# Altium project MB1292.PrjPcb (part 1 of 2)
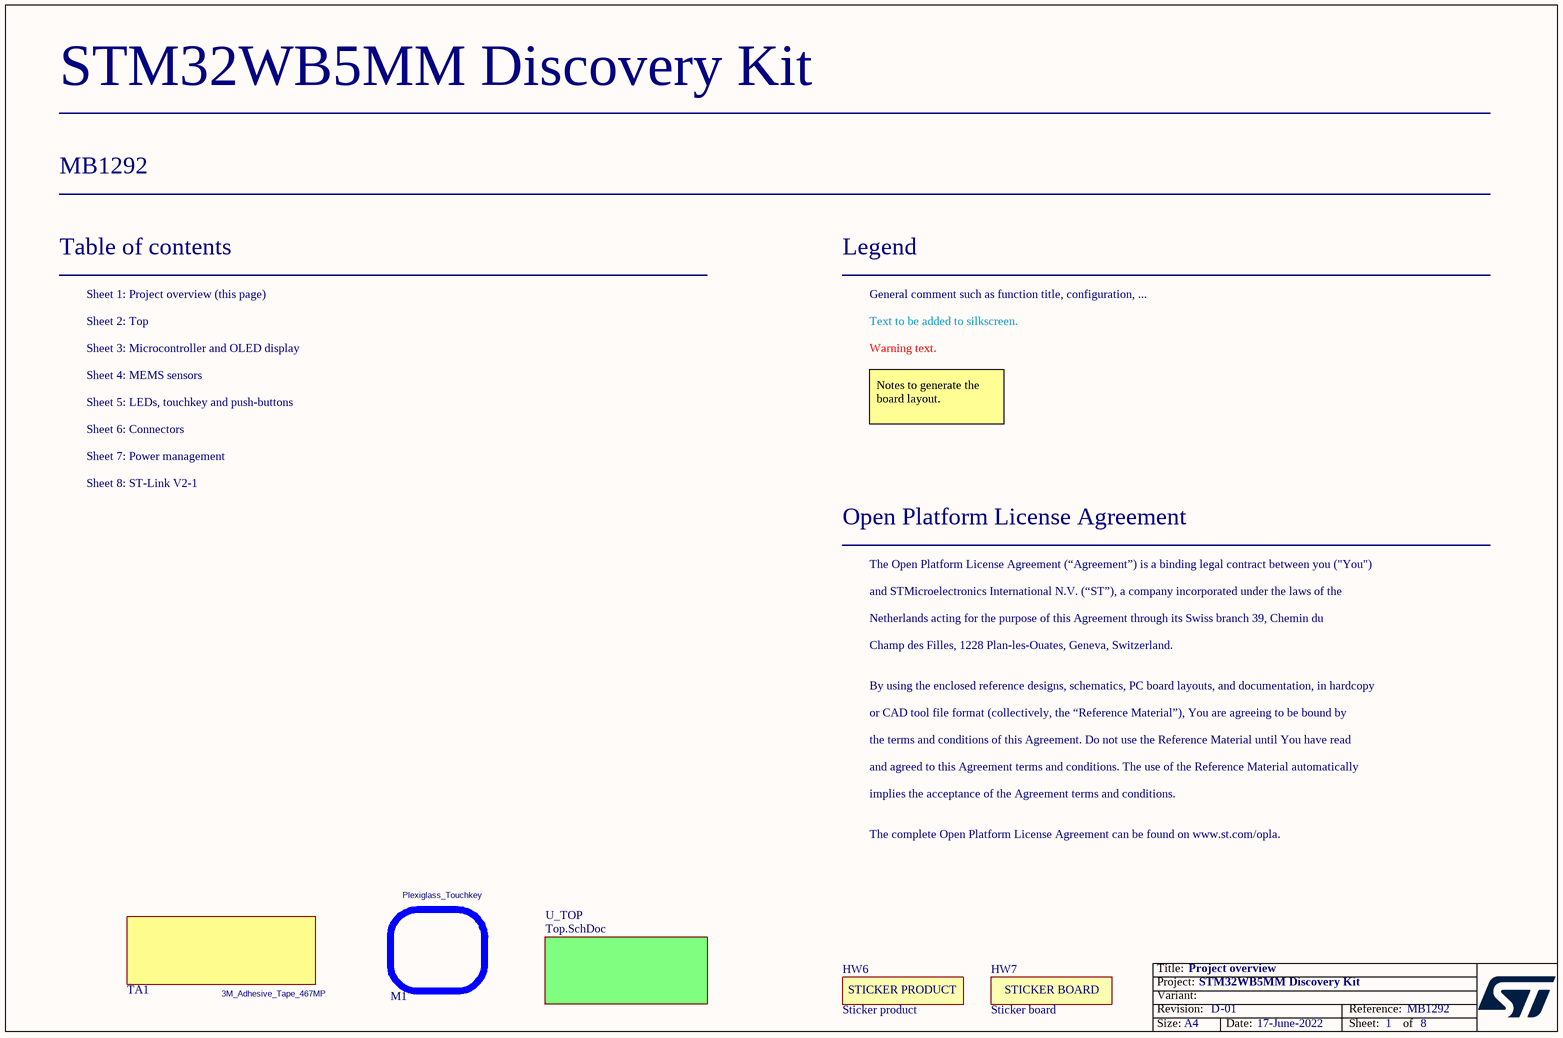
[diagram p0: Project_Overview.SchDoc]
Board_Assembly_Revision: 01; Board_Document_Date: 17-June-2022; Board_Name: STM32WB5MM Discovery Kit; Board_PCB_Revision: D; Board_Reference: MB1292
6 sheets, 170 parts. Net scope: flat (ports and power ports of the same name join across sheets).
Board file: MB1292.PcbDoc
Sheets:
  Project_Overview.SchDoc
  MCU_Display.SchDoc
  LEDs_Buttons.SchDoc
  Connectors.SchDoc
  Power_management.SchDoc
  ST-LINK_V2-1.SchDoc

## Sheet Project_Overview.SchDoc: Project overview
size A4; Date: Not used; ApprovedBy: Not used; CheckedBy: Not used; Author: Not used; CompanyName: STMicroelectronics; DrawnBy: Not used; Engineer: Not used; Organization: Not used; Address1: Not used; Address2: Not used; Address3: Not used; Address4: Not used; DocumentNumber: Not used; Revision: Not used; SheetNumber: 1; SheetTotal: 8; CurrentTime: Not used; CurrentDate: Not used; Time: Not used; DocumentFullPathAndName: Not used; DocumentName: Not used; ModifiedDate: Not used; ImagePath: Not used; ProjectName: Not used; Application_BuildNumber: Not used

### Parts
HW6  value Sticker product  [STICKER_PRODUCT_25X9]  (hidden comment: STICKER_PRODUCT)  (no BOM)
HW7  value Sticker board  [STICKER_BOARD_25X9]  (hidden comment: STICKER_BOARD)  (no BOM)
M1  Plexiglass_Touchkey  [Plexiglass_Touchkey]
TA1  3M_Adhesive_Tape_467MP  [3M_Adhesive_Tape_467MP]

### Sub-sheets
U_TOP = Top.SchDoc (file not in this document): no entries

### Notes on the sheet
- Table of contents
- Sheet 1: Project overview (this page)
- Legend
- General comment such as function title, configuration, ...
- Sheet 2: Top
- Sheet 3: Microcontroller and OLED display
- Sheet 4: MEMS sensors
- Text to be added to silkscreen.
- Warning text.
- Sheet 6: Connectors
- Sheet 5: LEDs, touchkey and push-buttons
- Notes to generate the board layout.
- Sheet 7: Power management
- Sheet 8: ST-Link V2-1
- Open Platform License Agreement
- The Open Platform License Agreement (“Agreement”) is a binding legal contract between you ("You")
- and STMicroelectronics International N.V. (“ST”), a company incorporated under the laws of the
- Netherlands acting for the purpose of this Agreement through its Swiss branch 39, Chemin du
- Champ des Filles, 1228 Plan-les-Ouates, Geneva, Switzerland.
- By using the enclosed reference designs, schematics, PC board layouts, and documentation, in hardcopy
- or CAD tool file format (collectively, the “Reference Material”), You are agreeing to be bound by
- the terms and conditions of this Agreement. Do not use the Reference Material until You have read
- and agreed to this Agreement terms and conditions. The use of the Reference Material automatically
- implies the acceptance of the Agreement terms and conditions.
- The complete Open Platform License Agreement can be found on www.st.com/opla.
- Title:
- Project:
- Size:
- Revision:
- Variant:
- A4
- -
- Date:
- Reference:
- Sheet:
- of
- (in symbol MCD-00235) STICKER BOARD
- (in symbol MCD-00547) STICKER PRODUCT

### Library data of the parts
HW6 = MCD-00547: Sticker product 25x9 mm; Part_Preference: Recommended; Part_Type: Misc; Internal_Part_Number: MCD-00547; Status: Released; Manufacturer: N/A; Manufacturer_Part_Number: N/A; Alternate_Manufacturer: N/A; Alternate_Manufacturer_Part_Number: N/A; Package: N/A; ComponentLink1URL: N/A; Order_Code_Digikey: N/A; Order_Code_Farnell: N/A; Order_Code_RS: N/A
HW7 = MCD-00235: Sticker Board 25x9 mm; Part_Preference: Recommended; Part_Type: Misc; Internal_Part_Number: MCD-00235; Status: Released; Manufacturer: N/A; Manufacturer_Part_Number: N/A; Alternate_Manufacturer: N/A; Alternate_Manufacturer_Part_Number: N/A; Package: N/A; ComponentLink1URL: N/A; Order_Code_Digikey: N/A; Order_Code_Farnell: N/A; Order_Code_RS: N/A
M1 = Plexiglass_Touchkey: Internal_Part_Number: MCD-04131; Part_Preference: Recommended; Manufacturer: N/A; Manufacturer_Part_Number: N/A; Status: Released
TA1 = 3M_Adhesive_Tape_467MP: Internal_Part_Number: MCD-04132; Part_Preference: Recommended; Manufacturer: N/A; Manufacturer_Part_Number: N/A; Status: Released

## Sheet MCU_Display.SchDoc: Microcontroller and OLED display
size A4; Date: Not used; ApprovedBy: Not used; CheckedBy: Not used; Author: Not used; CompanyName: STMicroelectronics; DrawnBy: Not used; Engineer: Not used; Organization: Not used; Address1: Not used; Address2: Not used; Address3: Not used; Address4: Not used; DocumentNumber: Not used; Revision: Not used; SheetNumber: 3; SheetTotal: 8; CurrentTime: Not used; CurrentDate: Not used; Time: Not used; DocumentFullPathAndName: Not used; DocumentName: Not used; ModifiedDate: Not used; ImagePath: Not used; ProjectName: Not used; Application_BuildNumber: Not used
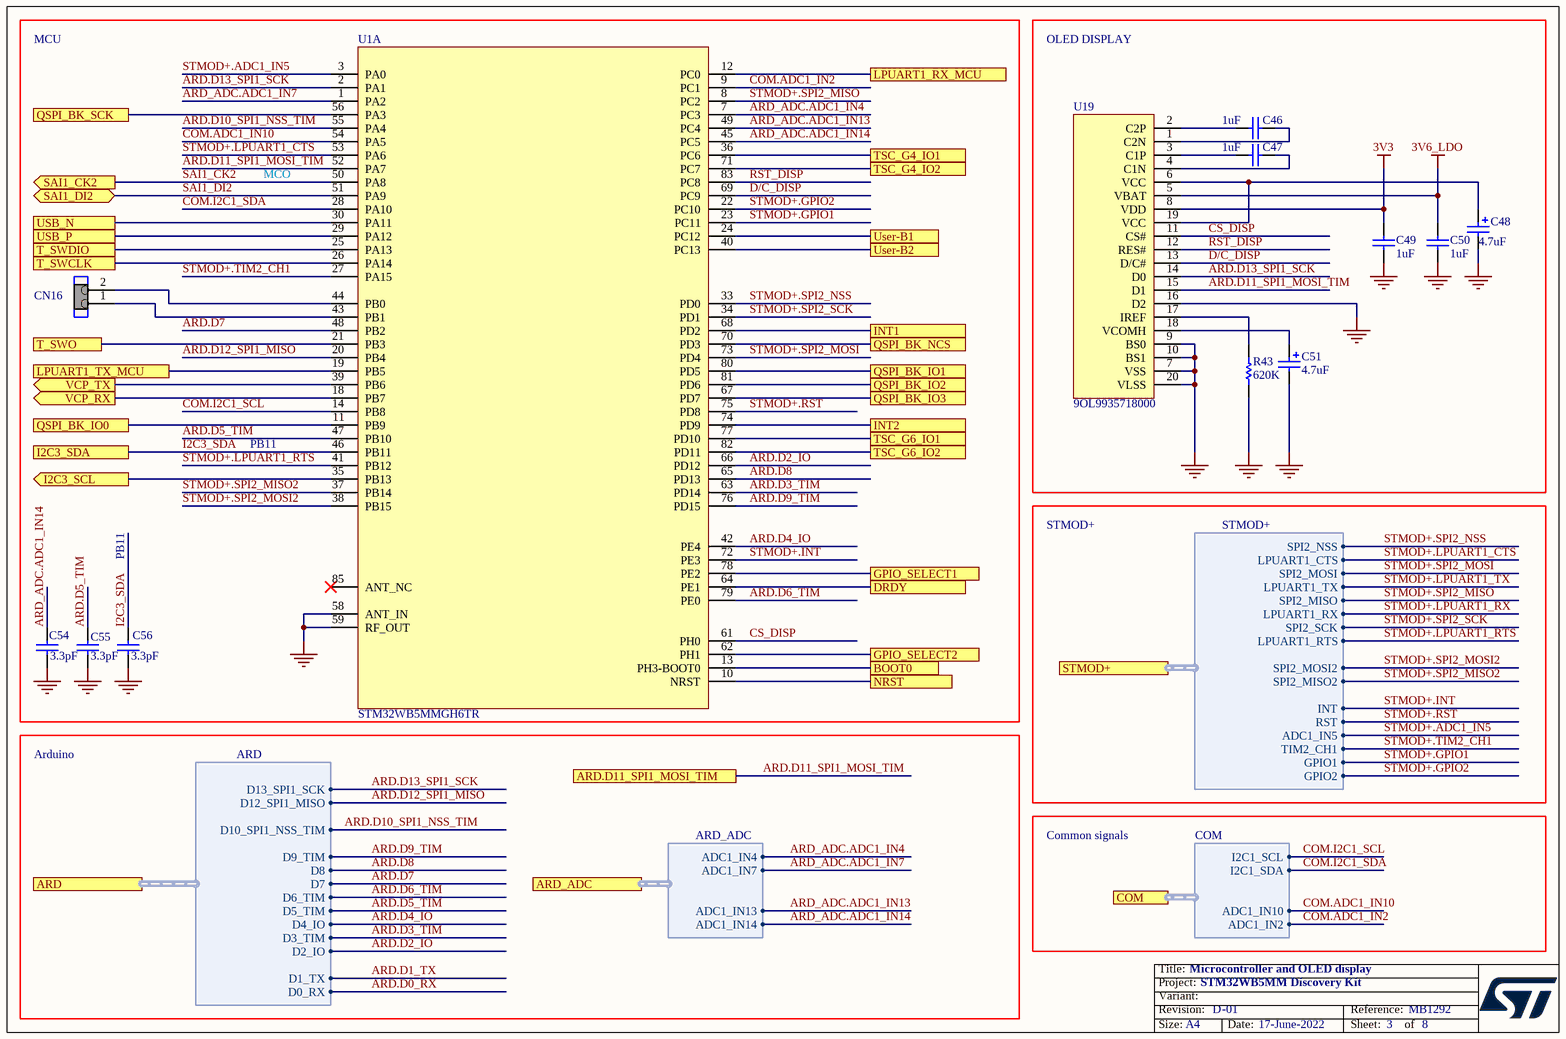
[diagram p1: MCU_Display.SchDoc]

### Parts
C46  value 1uF  [C0603]  (hidden comment: Capacitor)
C47  value 1uF  [C0603]  (hidden comment: Capacitor)
C48  value 4.7uF  [CPOL_TAJ-A_1206_H180]  (hidden comment: Cap_POL_TANA)
C49  value 1uF  [C0603]  (hidden comment: Capacitor)
C50  value 1uF  [C0603]  (hidden comment: Capacitor)
C51  value 4.7uF  [CPOL_TAJ-A_1206_H180]  (hidden comment: Cap_POL_TANA)
C54  value 3.3pF  [C0201_H0P3]  (hidden comment: Capacitor)
C55  value 3.3pF  [C0201_H0P3]  (hidden comment: Capacitor)
C56  value 3.3pF  [C0201_H0P3]  (hidden comment: Capacitor)
CN16  Jumper_Header1.27 2x1 Fitted  [CON_WP_707-2-02-2-20-00]  (value not drawn)
R43  value 620K  [R0603]  (hidden comment: Resistor)
U1  STM32WB5MMGH6TR  [MOD_DORY_STM_86P_7P3X11_H1P342]  (part A of 2)
U19  value 9OL9935718000  [OLED_RITDISPLAY_9OL9935718000]  (hidden comment: OLED_RITDISPLAY_9OL9935718000)

### Blocks framed on the sheet
OLED DISPLAY: C46-C51 R43 U19

### Ports
ARD (harness ARD), ARD.D11_SPI1_MOSI_TIM, ARD_ADC (harness ARD_ADC), BOOT0, COM (harness COM), DRDY, GPIO_SELECT1, GPIO_SELECT2, I2C3_SCL (out), I2C3_SDA, INT1, INT2, LPUART1_RX_MCU, LPUART1_TX_MCU, NRST, QSPI_BK_IO0, QSPI_BK_IO1, QSPI_BK_IO2, QSPI_BK_IO3, QSPI_BK_NCS, QSPI_BK_SCK, SAI1_CK2 (out), SAI1_DI2 (bidir), STMOD+ (harness STMOD+), T_SWCLK, T_SWDIO, T_SWO, TSC_G4_IO1, TSC_G4_IO2, TSC_G6_IO1, TSC_G6_IO2, USB_N, USB_P, User-B1, User-B2, VCP_RX (out), VCP_TX (out)

### Harnesses
STMOD+: SPI2_NSS, LPUART1_CTS, SPI2_MOSI, LPUART1_TX, SPI2_MISO, SPI2_SCK, LPUART1_RX, LPUART1_RTS, SPI2_MOSI2, SPI2_MISO2, INT, RST, ADC1_IN5, TIM2_CH1, GPIO1, GPIO2
ARD: D0_RX, D1_TX, D2_IO, D3_TIM, D4_IO, D5_TIM, D6_TIM, D7, D8, D9_TIM, D10_SPI1_NSS_TIM, D12_SPI1_MISO, D13_SPI1_SCK
ARD_ADC: ADC1_IN4, ADC1_IN7, ADC1_IN13, ADC1_IN14
COM: I2C1_SCL, I2C1_SDA, ADC1_IN10, ADC1_IN2

### Nets
3V3: C49.1 U19.8(VDD)
3V6_LDO: C50.1 U19.5(VBAT)
GND: C48.2 C49.2 C50.2 C51.2 C54.2 C55.1 C56.1 R43.1 U1.58(ANT_IN) U1.59(RF_OUT) U19.7(VSS) U19.9(BS0) U19.10(BS1) U19.16(D2) U19.20(VLSS)
ARD.D2_IO: U1.66(PD12) ; port ARD.D2_IO
ARD.D3_TIM: U1.63(PD14) ; port ARD.D3_TIM
ARD.D4_IO: U1.42(PE4) ; port ARD.D4_IO
ARD.D5_TIM: C55.2 U1.47(PB10) ; port ARD.D5_TIM
ARD.D6_TIM: U1.79(PE0) ; port ARD.D6_TIM
ARD.D7: U1.48(PB2) ; port ARD.D7
ARD.D8: U1.65(PD13) ; port ARD.D8
ARD.D9_TIM: U1.76(PD15) ; port ARD.D9_TIM
ARD.D10_SPI1_NSS_TIM: U1.55(PA4) ; port ARD.D10_SPI1_NSS_TIM
ARD.D11_SPI1_MOSI_TIM: U1.52(PA7) U19.15(D1) ; port ARD.D11_SPI1_MOSI_TIM
ARD.D12_SPI1_MISO: U1.20(PB4) ; port ARD.D12_SPI1_MISO
ARD.D13_SPI1_SCK: U1.2(PA1) U19.14(D0) ; port ARD.D13_SPI1_SCK
ARD_ADC.ADC1_IN4: U1.7(PC3) ; port ARD_ADC.ADC1_IN4
ARD_ADC.ADC1_IN7: U1.1(PA2) ; port ARD_ADC.ADC1_IN7
ARD_ADC.ADC1_IN13: U1.49(PC4) ; port ARD_ADC.ADC1_IN13
ARD_ADC.ADC1_IN14: C54.1 U1.45(PC5) ; port ARD_ADC.ADC1_IN14
BOOT0: U1.13(PH3-BOOT0) ; port BOOT0
COM.ADC1_IN2: U1.9(PC1) ; port COM.ADC1_IN2
COM.ADC1_IN10: U1.54(PA5) ; port COM.ADC1_IN10
COM.I2C1_SCL: U1.14(PB8) ; port COM.I2C1_SCL
COM.I2C1_SDA: U1.28(PA10) ; port COM.I2C1_SDA
CS_DISP: U1.61(PH0) U19.11(CS#)
D/C_DISP: U1.69(PC9) U19.13(D/C#)
DRDY: U1.64(PE1) ; port DRDY
GPIO_SELECT1: U1.78(PE2) ; port GPIO_SELECT1
GPIO_SELECT2: U1.62(PH1) ; port GPIO_SELECT2
I2C3_SCL: U1.35(PB13) ; port I2C3_SCL
I2C3_SDA: C56.2 U1.46(PB11) ; port I2C3_SDA
INT1: U1.68(PD2) ; port INT1
INT2: U1.74(PD9) ; port INT2
LPUART1_RX_MCU: U1.12(PC0) ; port LPUART1_RX_MCU
LPUART1_TX_MCU: U1.19(PB5) ; port LPUART1_TX_MCU
NRST: U1.10(NRST) ; port NRST
QSPI_BK_IO0: U1.11(PB9) ; port QSPI_BK_IO0
QSPI_BK_IO1: U1.80(PD5) ; port QSPI_BK_IO1
QSPI_BK_IO2: U1.81(PD6) ; port QSPI_BK_IO2
QSPI_BK_IO3: U1.67(PD7) ; port QSPI_BK_IO3
QSPI_BK_NCS: U1.70(PD3) ; port QSPI_BK_NCS
QSPI_BK_SCK: U1.56(PA3) ; port QSPI_BK_SCK
RST_DISP: U1.83(PC8) U19.12(RES#)
SAI1_CK2: U1.50(PA8) ; port SAI1_CK2
SAI1_DI2: U1.51(PA9) ; port SAI1_DI2
STMOD+.ADC1_IN5: U1.3(PA0) ; port STMOD+.ADC1_IN5
STMOD+.GPIO1: U1.23(PC11) ; port STMOD+.GPIO1
STMOD+.GPIO2: U1.22(PC10) ; port STMOD+.GPIO2
STMOD+.INT: U1.72(PE3) ; port STMOD+.INT
STMOD+.LPUART1_CTS: U1.53(PA6) ; port STMOD+.LPUART1_CTS
STMOD+.LPUART1_RTS: U1.41(PB12) ; port STMOD+.LPUART1_RTS
STMOD+.RST: U1.75(PD8) ; port STMOD+.RST
STMOD+.SPI2_MISO: U1.8(PC2) ; port STMOD+.SPI2_MISO
STMOD+.SPI2_MISO2: U1.37(PB14) ; port STMOD+.SPI2_MISO2
STMOD+.SPI2_MOSI: U1.73(PD4) ; port STMOD+.SPI2_MOSI
STMOD+.SPI2_MOSI2: U1.38(PB15) ; port STMOD+.SPI2_MOSI2
STMOD+.SPI2_NSS: U1.33(PD0) ; port STMOD+.SPI2_NSS
STMOD+.SPI2_SCK: U1.34(PD1) ; port STMOD+.SPI2_SCK
STMOD+.TIM2_CH1: U1.27(PA15) ; port STMOD+.TIM2_CH1
T_SWCLK: U1.26(PA14) ; port T_SWCLK
T_SWDIO: U1.25(PA13) ; port T_SWDIO
T_SWO: U1.21(PB3) ; port T_SWO
TSC_G4_IO1: U1.36(PC6) ; port TSC_G4_IO1
TSC_G4_IO2: U1.71(PC7) ; port TSC_G4_IO2
TSC_G6_IO1: U1.77(PD10) ; port TSC_G6_IO1
TSC_G6_IO2: U1.82(PD11) ; port TSC_G6_IO2
USB_N: U1.30(PA11) ; port USB_N
USB_P: U1.29(PA12) ; port USB_P
User-B1: U1.24(PC12) ; port User-B1
User-B2: U1.40(PC13) ; port User-B2
VCP_RX: U1.18(PB7) ; port VCP_RX
VCP_TX: U1.39(PB6) ; port VCP_TX
NetC46_1: C46.1 U19.2(C2P)
NetC46_2: C46.2 U19.1(C2N)
NetC47_1: C47.1 U19.3(C1P)
NetC47_2: C47.2 U19.4(C1N)
NetC48_1: C48.1 U19.6(VCC) U19.19(VCC)
NetC51_1: C51.1 U19.18(VCOMH)
NetCN16_1: CN16.1 U1.43(PB1)
NetCN16_2: CN16.2 U1.44(PB0)
NetR43_2: R43.2 U19.17(IREF)

Not connected (* = marked no-connect by the designer): U1 85(ANT_NC)*

### Notes on the sheet
- MCU
- MCO
- PB11
- STMOD+
- Arduino
- Common signals
- Title:
- Project:
- Size:
- Revision:
- Variant:
- A4
- -
- Date:
- Reference:
- Sheet:
- of

### Library data of the parts
C46 C47 C49 C50 = MCD-00010: Capacitor, MLCC, 1uF, 16V, X5R, +/-10%, 0603, T=0,8mm; Manufacturer_Part_Number: CC0603KRX5R7BB105; Manufacturer: YAGEO; Part_Preference: Recommended; Internal_Part_Number: MCD-00010; Status: Released; Part_Type: Capacitor; Package: C0603; ComponentLink1URL: http://tunmcdsvn.tun.st.com/Component_Datasheet_Library/Trunk/Capacitors/Yageo_Multilayer_capacitor_X5R_series_100pF_to_100uF; Order_Code_Digikey: 311-1444-1-ND; Order_Code_Farnell: 2370680; Order_Code_RS: N/A
C48 C51 = MCD-01043: Capacitor, Tantalum, 4.7uF, 25V, 5.5ohms, 10%,pkg Type_A (3216 metric), T=1.6mm; Manufacturer_Part_Number: 293D475X9025A2TE3; Manufacturer: VISHAY; Part_Preference: Recommended; Order_Code_RS: 179-7472; Revision: July-2002: Re-released for DXP Platform.; Internal_Part_Number: MCD-01043; Status: Checked; Part_Type: Capacitor; Package: Type_A; ComponentLink1URL: http://tunmcdsvn.tun.st.com/Component_Datasheet_Library/Trunk/Capacitors/VISHAY_CAPACITOR_TANTALUM_293D; Order_Code_Farnell: 2666694; Alternate_Manufacturer: N/A; Alternate_Manufacturer_Part_Number: N/A; Order_Code_Digikey: N/A
C54-C56 = MCD-02284: Capacitor, MLCC, 3.3pF, 50V, NPO, +-0.05pF, 0201, T=0.3mm".; Part_Preference: Recommended; Manufacturer: MURATA; Manufacturer_Part_Number: GRM0335C2A3R3WA01J; Internal_Part_Number: MCD-02284; Status: Checked; Part_Type: Capacitor; Alternate_Manufacturer: N/A; Alternate_Manufacturer_Part_Number: N/A; Package: C0201; ComponentLink1URL: http://tunmcdsvn.tun.st.com/Component_Datasheet_Library/Trunk/Capacitors/MURATA_Capacitor_GRM_series/MURATA_GRM_Datasheet.pdf; Order_Code_Digikey: N/A; Order_Code_Farnell: N/A; Order_Code_RS: N/A
CN16 = MCD-01428: Header, 2x1, 1.27mm, RA, TH, T=3.05mm/1.27mm; Part_Type: Connector; Part_Preference: Recommended; Manufacturer: W&P PRODUCTS; Manufacturer_Part_Number: 707-2-02-2-20-00; Value: Header 2x1; Component_Country_Of_Origin: China; ShowFields: YES; ID: 3528; Internal_Part_Number: MCD-01428; Status: Checked; ComponentLink1URL: http://tunmcdsvn.tun.st.com/Component_Documentation_Library/Trunk/Connector/W&P_PRODUCTS_707_Series/; Order_Code_Digikey: N/A; Order_Code_Farnell: N/A; Order_Code_RS: N/A
R43 = MCD-00506: Resistor,620K,0603,1%,1/10W; Manufacturer_Part_Number: RC0603FR-07620KL; Manufacturer: YAGEO; Part_Preference: Recommended; Internal_Part_Number: MCD-00506; Status: Released; Part_Type: Resistor; Package: R0603; ComponentLink1URL: http://tunmcdsvn.tun.st.com/Component_Datasheet_Library/Trunk/Resistors/Yageo_Resistor_RC0603-series; Order_Code_Digikey: 311-620KHRCT-ND; Order_Code_Farnell: N/A; Order_Code_RS: N/A
U1 = MCD-01965: STM32 BLE module based on STM32WB55; Part_Type: Misc; Manufacturer: STMICROELECTRONICS; Part_Preference: Recommended; Manufacturer_HQ_COO: EU; Component_Country_Of_Origin: Taiwan; Value: STM32WB5MMGH6TR; Order_Code_Digikey: N/A; Order_Code_Farnell: N/A; Order_Code_RS: N/A; Status: Checked; ComponentLink1URL: http://tunmcdsvn.tun.st.com/Component_Datasheet_Library/Trunk/Misc/STM_STM32WBxxx_dory_module; Internal_Part_Number: MCD-01965; Manufacturer_Part_Number: STM32WB5MMGH6TR; Alternate_Manufacturer_Part_Number: N/A; Alternate_Manufacturer: N/A
U19 = MCD-01925: 128*64 Dots 20-pin OLED display; Alternate_Manufacturer_Part_Number: 9OL9935701000; Part_Preference: Recommended; Internal_Part_Number: MCD-01925; Status: Released; Part_Type: Display; Manufacturer_Part_Number: 9OL9935718000; Manufacturer: RITDISPLAY; Alternate_Manufacturer: RITDISPLAY; Package: SMT; ComponentLink1URL: http://tunmcdsvn.tun.st.com/Component_Datasheet_Library/Trunk/Display/RiTDisplay_128x64_OLED_white_9OL9935718000; Order_Code_Digikey: N/A; Order_Code_Farnell: N/A; Order_Code_RS: N/A

## Sheet LEDs_Buttons.SchDoc: LEDs, touchkey and push-buttons
size A4; Date: Not used; ApprovedBy: Not used; CheckedBy: Not used; Author: Not used; CompanyName: STMicroelectronics; DrawnBy: Not used; Engineer: Not used; Organization: Not used; Address1: Not used; Address2: Not used; Address3: Not used; Address4: Not used; DocumentNumber: Not used; Revision: Not used; SheetNumber: 5; SheetTotal: 8; CurrentTime: Not used; CurrentDate: Not used; Time: Not used; DocumentFullPathAndName: Not used; DocumentName: Not used; ModifiedDate: Not used; ImagePath: Not used; ProjectName: Not used; Application_BuildNumber: Not used
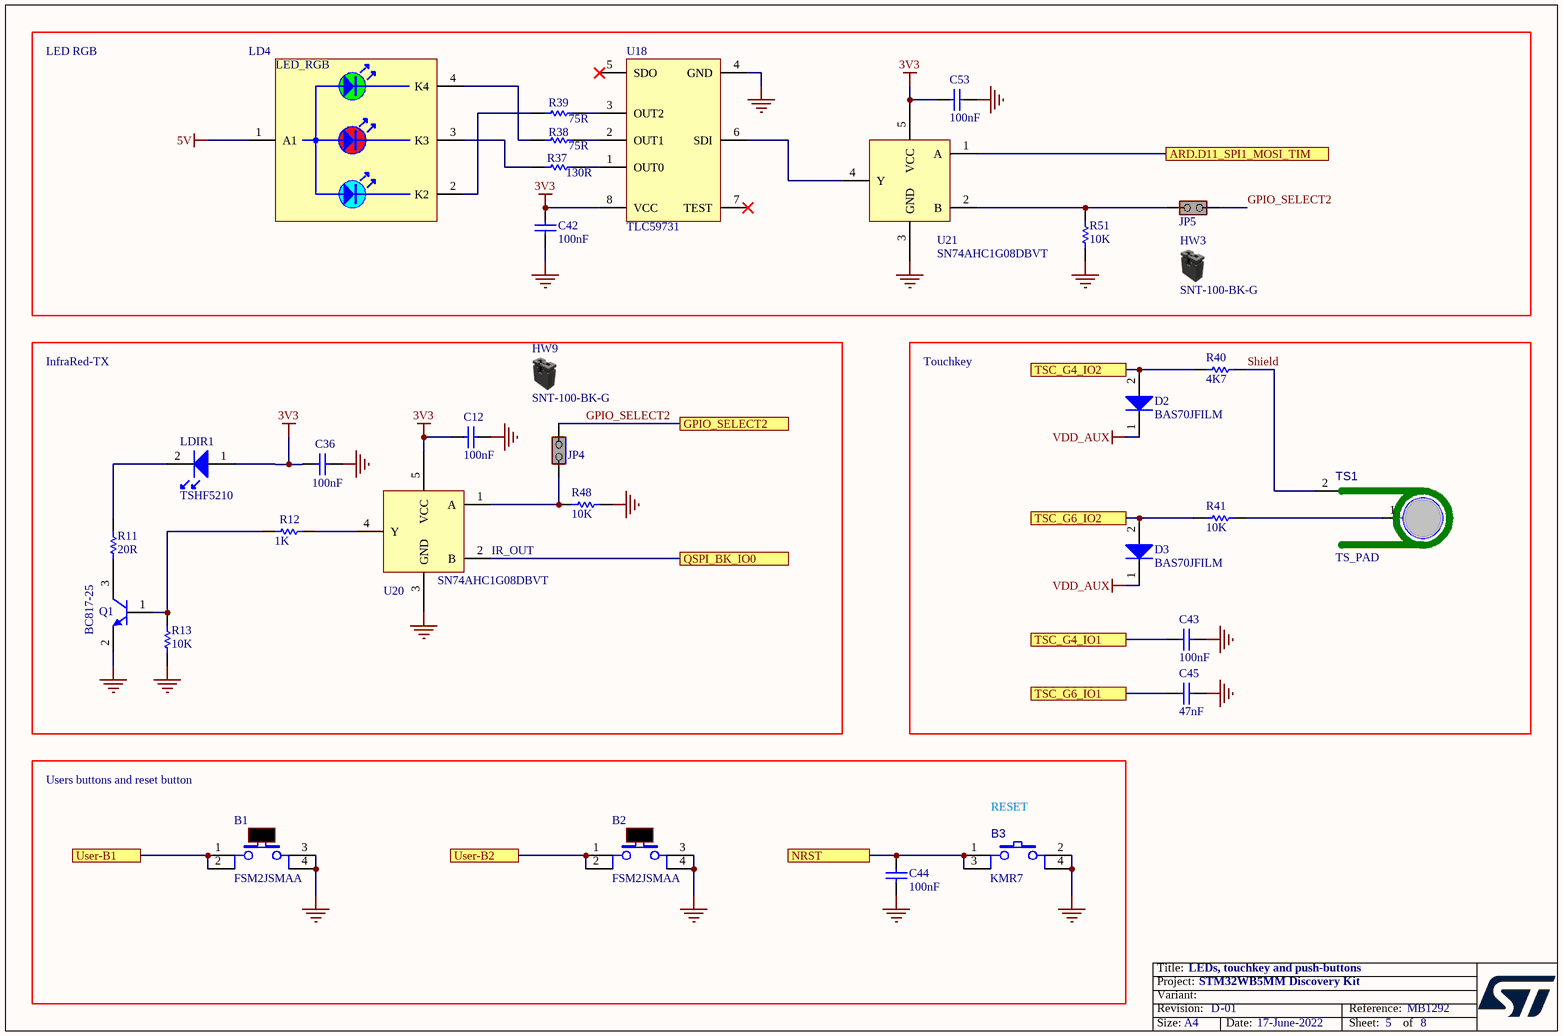
[diagram p2: LEDs_Buttons.SchDoc]

### Parts
B1  FSM2JSMAA  [SWI_TE_FSM2JSMAA_WHITE]
B2  FSM2JSMAA  [SWI_TE_FSM2JSMAA_WHITE]
B3  value KMR7  [SWI_C&K_KMR721NG-LFS]  (hidden comment: SW-PUSH-CMS_KMR_NG)
C12  value 100nF  [C0402]  (hidden comment: Capacitor)
C36  value 100nF  [C0402]  (hidden comment: Capacitor)
C42  value 100nF  [C0402]  (hidden comment: Capacitor)
C43  value 100nF  [C1206_H1P6]  (hidden comment: Capacitor)
C44  value 100nF  [C0402]  (hidden comment: Capacitor)
C45  value 47nF  [C0805_KEMET_IPC-7351_DENSITY-LEVEL-B_H1P25]  (hidden comment: Capacitor)
C53  value 100nF  [C0402]  (hidden comment: Capacitor)
D2  value BAS70JFILM  [DIO_SOD323_1K_2A]  (hidden comment: DIODE_1K_2A)
D3  value BAS70JFILM  [DIO_SOD323_1K_2A]  (hidden comment: DIODE_1K_2A)
HW3  value SNT-100-BK-G  (hidden comment: Shunt Black 2.54mm)  (mechanical)
HW9  value SNT-100-BK-G  (hidden comment: Shunt Black 2.54mm)  (mechanical)
JP4  Jumper_Header 2x1 Fitted  [CON_SAMTEC_TSW-102-07-G-S]  (value not drawn)
JP5  Jumper_Header 2x1 Fitted  [CON_SAMTEC_TSW-102-07-G-S]  (value not drawn)
LD4  LED_RGB  [LED_TRI-RGB_WURTH_150141M173100]
LDIR1  TSHF5210  [LED_INFRARED_VISHAY_TSHF5210_IN-MODE-SMT_BOARD-EDGE_1A2K_P254]
Q1  value BC817-25  [NPN_SOT23]  (hidden comment: 9013-SOT23)
R11  value 20R  [R0603]  (hidden comment: Resistor)
R12  value 1K  [R0402]  (hidden comment: Resistor)
R13  value 10K  [R0402]  (hidden comment: Resistor)
R37  value 130R  [R0603]  (hidden comment: Resistor)
R38  value 75R  [R0603]  (hidden comment: Resistor)
R39  value 75R  [R0603]  (hidden comment: Resistor)
R40  value 4K7  [R0603]  (hidden comment: Resistor)
R41  value 10K  [R0603]  (hidden comment: Resistor)
R48  value 10K  [R0402]  (hidden comment: Resistor)
R51  value 10K  [R0402]  (hidden comment: Resistor)
TS1  TS_PAD  [TSB_TOUCH-SENSING-BUTTON_TS-PAD-10_SHIELD-14_2]  (no BOM)
U18  TLC59731  [ICC_SOIC8_3P91X4P90_P127_H1P75]
U20  SN74AHC1G08DBVT  [ICC_SOT23-5L_H1P45]
U21  SN74AHC1G08DBVT  [ICC_SOT23-5L_H1P45]

### Blocks framed on the sheet
LED RGB: C42 C53 HW3 JP5 LD4 R37-R39 R51 U18 U21
Touchkey: C43 C45 D2 D3 R40 R41 TS1

### Ports
ARD.D11_SPI1_MOSI_TIM, GPIO_SELECT2, NRST, QSPI_BK_IO0, TSC_G4_IO1, TSC_G4_IO2, TSC_G6_IO1, TSC_G6_IO2, User-B1, User-B2

### Nets
3V3: C12.2 C36.2 C42.2 C53.2 LDIR1.1(A) U18.8(VCC) U20.5(VCC) U21.5(VCC)
5V: LD4.1(A1)
GND: B1.3 B1.4 B2.3 B2.4 B3.2 B3.4 C12.1 C36.1 C42.1 C43.1 C44.2 C45.2 C53.1 Q1.2(E) R13.1 R48.2 R51.1 U18.4(GND) U20.3(GND) U21.3(GND)
VDD_AUX: D2.1(K) D3.1(K)
ARD.D11_SPI1_MOSI_TIM: U21.1(A) ; port ARD.D11_SPI1_MOSI_TIM
GPIO_SELECT2: JP4.1(COMMON) JP5.2(NO) ; port GPIO_SELECT2
NRST: B3.1 B3.3 C44.1 ; port NRST
QSPI_BK_IO0: U20.2(B) ; port QSPI_BK_IO0
Shield: R40.2 TS1.2(SHIELD)
TSC_G4_IO1: C43.2 ; port TSC_G4_IO1
TSC_G4_IO2: D2.2(A) R40.1 ; port TSC_G4_IO2
TSC_G6_IO1: C45.1 ; port TSC_G6_IO1
TSC_G6_IO2: D3.2(A) R41.1 ; port TSC_G6_IO2
User-B1: B1.1 B1.2 ; port User-B1
User-B2: B2.1 B2.2 ; port User-B2
NetJP4_2: JP4.2(NO) R48.1 U20.1(A)
NetJP5_1: JP5.1(COMMON) R51.2 U21.2(B)
NetLD4_2: LD4.2(K2) R39.1
NetLD4_3: LD4.3(K3) R37.1
NetLD4_4: LD4.4(K4) R38.1
NetLDIR1_2: LDIR1.2(K) R11.1
NetQ1_1: Q1.1(B) R12.1 R13.2
NetQ1_3: Q1.3(C) R11.2
NetR12_2: R12.2 U20.4(Y)
NetR37_2: R37.2 U18.1(OUT0)
NetR38_2: R38.2 U18.2(OUT1)
NetR39_2: R39.2 U18.3(OUT2)
NetR41_2: R41.2 TS1.1(TKEY)
NetU18_6: U18.6(SDI) U21.4(Y)

Not connected (* = marked no-connect by the designer): U18 5(SDO)* 7(TEST)*

### Notes on the sheet
- InfraRed-TX
- (near U20) IR_OUT
- Users buttons and reset button
- (near B3) RESET
- Title:
- Project:
- Size:
- Revision:
- Variant:
- A4
- -
- Date:
- Reference:
- Sheet:
- of

### Library data of the parts
B1 B2 = MCD-02280: Tactile SWITCH  SPST .05A 24V; Part_Type: Misc; Part_Preference: Recommended; Manufacturer: TE CONNECTIVITY; Order_Code_RS: 718-2465; Component_Country_Of_Origin: China; ShowFields: YES; ID: 4380; Internal_Part_Number: MCD-02280; Value: FSM2JSMAA; Status: Released; Manufacturer_Part_Number: FSM2JSMAA; Package: SMD package; ComponentLink1URL: http://tunmcdsvn.tun.st.com/Component_Documentation_Library/Trunk/Misc/TE_CONNECTIVITY_FSM2JSMAA; Order_Code_Digikey: 450-1792-1-ND; Order_Code_Farnell: 3133602
B3 = MCD-01510: Microminiature SMT Top, 2N, N.O., IP67; Part_Type: Misc; Manufacturer_Part_Number: KMR721NG LFS; Manufacturer: C&K; Part_Preference: Recommended; Internal_Part_Number: MCD-01510; Status: New; Package: KMR7; ComponentLink1URL: http://tunmcdsvn.tun.st.com/Component_Datasheet_Library/Trunk/Misc/C&K_KMR7/kmr7.pdf
C12 C36 C42 C44 C53 = MCD-00006: Capacitor, MLCC, 100nF, 16V, X7R, +/-10%, 0402, T=0.5mm; Manufacturer_Part_Number: CC0402KRX7R7BB104; Manufacturer: YAGEO; Alternate_Manufacturer_Part_Number: GCM155R71C104KA55D; Alternate_Manufacturer: MURATA; Part_Preference: Recommended; Order_Code_RS: 616-9701; Internal_Part_Number: MCD-00006; Status: Released; Part_Type: Capacitor; Package: C0402; ComponentLink1URL: http://tunmcdsvn.tun.st.com/Component_Datasheet_Library/Trunk/Capacitors/Yageo_Multilayer_Capacitor_X7R_series_100pF_to_22uF; Order_Code_Digikey: 311-1338-1-ND; Order_Code_Farnell: 9402047
C43 = MCD-02039: Capacitor, COG, 100nF, 25V , 1206, 5%; Manufacturer_Part_Number: C1206X104J3GACTU; Manufacturer: KEMET; Part_Preference: Recommended; Internal_Part_Number: MCD-02039; Status: Released; Part_Type: Capacitor; Package: C1206; ComponentLink1URL: http://tunmcdsvn.tun.st.com/Component_Datasheet_Library/Trunk/Capacitors/KEMET_Capacitor_C0G-series; Order_Code_Digikey: N/A; Order_Code_Farnell: 2760643; Order_Code_RS: N/A; Alternate_Manufacturer: N/A; Alternate_Manufacturer_Part_Number: N/A
C45 = MCD-02040: Capacitor, MLCC, 47nF, 25V,COG, +/- 5%, 0805, T=1.25 mm; Part_Preference: Recommended; Manufacturer: KEMET; Manufacturer_Part_Number: C0805C473J3GACTU; Component_Country_Of_Origin: Mexico; ShowFields: YES; ID: 4140; Internal_Part_Number: MCD-02040; Status: Released; Part_Type: Capacitor; Package: 0805; ComponentLink1URL: http://tunmcdsvn.tun.st.com/Component_Documentation_Library/Trunk/Capacitor/KEMET_C0G_Series; Order_Code_Digikey: N/A; Order_Code_Farnell: 1535570; Order_Code_RS: N/A
D2 D3 = MCD-01880: ultrafast and RF switching diode, VF = 0.41 V @ IF = 1mA; VR = 70V;; Manufacturer: STMICROELECTRONICS; BMS_Part_Number: 9151076; Part_Preference: Recommended; Manufacturer_HQ_COO: EU; Order_Code_RS: 714-0486; Component_Country_Of_Origin: China; Internal_Part_Number: MCD-01880; Status: Released; Part_Type: Diode; Manufacturer_Part_Number: BAS70JFILM; Package: SOD-323; ComponentLink1URL: http://tunmcdsvn.tun.st.com/Component_Datasheet_Library/Trunk/Diodes/STM_SCHOTTKY_BAS70JFILM; Alternate_Manufacturer: N/A; Alternate_Manufacturer_Part_Number: N/A; Order_Code_Digikey: 497-6652-1-ND; Order_Code_Farnell: 9801413
HW3 HW9 = MCD-00122: Shunt, 2.54mm, Black, 4.3A, 6.1mm, 5mR; Part_Type: Misc; Part_Preference: Recommended; Manufacturer: SAMTEC; Full_Alternate_Internal_Part_Number: MCD-00043; Partial_Alternate_Internal_Part_Number: MCD-01849; Order_Code_RS: 158-7784; Component_Country_Of_Origin: China, Costa Rica, Malaysia, USA, Vietnam; ShowFields: YES; ID: 2749; Internal_Part_Number: MCD-00122; Status: Released; Manufacturer_Part_Number: SNT-100-BK-G; Package: 2.54x5.08mm; ComponentLink1URL: http://tunmcdsvn.tun.st.com/Component_Documentation_Library/Trunk/Misc/SAMTEC_SNT-100-BK-G; Order_Code_Digikey: SAM8858-ND; Order_Code_Farnell: 2505007
JP4 JP5 = MCD-01904: Header, 2x1, 2,54mm, VR, TH, Height 5.84mm/2.54mm - Shunt Fitted by default; Part_Type: Connector; Manufacturer_Part_Number: TSW-102-07-G-S; Manufacturer: SAMTEC; Part_Preference: Recommended; Order_Code_RS: 155-7981; Internal_Part_Number: MCD-01904; Value: Header 2x1; Status: Checked; ComponentLink1URL: http://tunmcdsvn.tun.st.com/Component_Datasheet_Library/Trunk/Connectors/Samtec_TSW-HTSW-series; Alternate_Manufacturer: N/A; Alternate_Manufacturer_Part_Number: N/A; Order_Code_Digikey: SAM1029-02-ND; Order_Code_Farnell: 2505044
LD4 = MCD-02035: LED, RGB 2,8x3,2mm; Part_Type: Display; Manufacturer: WURTH ELEKTRONIK; Part_Preference: Recommended; Value: 150141M173100; Order_Code_RS: 146-0091; Order_Code_Digikey: 732-4998-2-ND; Order_Code_Farnell: N/A; Status: Released; ComponentLink1URL: http://tunmcdsvn.tun.st.com/Component_Datasheet_Library/Trunk/Display/WURTH-ELEKTRONIK_LED-RGB_150141M173100; Internal_Part_Number: MCD-02035; Manufacturer_Part_Number: 150141M173100; Package: LED 1411
LDIR1 = MCD-02137: Diode infrared, 890nm emitting, T-1 3/4, 35,5mmx2.54mm; Part_Preference: Recommended; Manufacturer: VISHAY; Order_Code_RS: 699-7663; Internal_Part_Number: MCD-02137; Value: TSHF5210; Status: Checked; Part_Type: Diode; Manufacturer_Part_Number: TSHF5210; Alternate_Manufacturer: N/A; Alternate_Manufacturer_Part_Number: N/A; Package: T-1 3/4; ComponentLink1URL: http://tunmcdsvn.tun.st.com/Component_Datasheet_Library/Trunk/Diodes/Vishay_Diode-infrared_tshf5210; Order_Code_Digikey: 751-1210-ND; Order_Code_Farnell: 1779669
Q1 = MCD-01385: Transistor Bipolar NPN, 45V, 500mA, 100MHz, 300mW, SOT23-3; Part_Type: IC; Manufacturer_Part_Number: BC817-25LT3G; Manufacturer: ON SEMICONDUCTOR; Part_Preference: Recommended; Revision: *; Internal_Part_Number: MCD-01385; Status: Released; Package: SOT23-3; ComponentLink1URL: http://tunmcdsvn.tun.st.com/Component_Datasheet_Library/Trunk/IC/ON_SEMICONDUCTOR_Transistor_BC817-25LT3G
R11 = MCD-00345: Resistor,20R,0603,1%,1/10W; Manufacturer_Part_Number: RC0603FR-0720RL; Manufacturer: YAGEO; Part_Preference: Recommended; Internal_Part_Number: MCD-00345; Status: Released; Part_Type: Resistor; Package: R0603; ComponentLink1URL: http://tunmcdsvn.tun.st.com/Component_Datasheet_Library/Trunk/Resistors/Yageo_Resistor_RC0603-series; Order_Code_Digikey: 311-20.0HRCT-ND; Order_Code_Farnell: 1799333; Order_Code_RS: N/A
R12 = MCD-00061: Resistor,1K,0402,1%,1/16W; Manufacturer_Part_Number: RC0402FR-071KL; Manufacturer: YAGEO; Part_Preference: Recommended; Internal_Part_Number: MCD-00061; Status: Released; Part_Type: Resistor; Package: R0402; ComponentLink1URL: http://tunmcdsvn.tun.st.com/Component_Datasheet_Library/Trunk/Resistors/Yageo_Resistor_RC0402-series; Order_Code_Digikey: 311-1.00KLRCT-ND; Order_Code_Farnell: 9239235; Order_Code_RS: N/A
R13 R48 R51 = MCD-00053: Resistor,10K,0402,1%,1/16W; Manufacturer_Part_Number: RC0402FR-0710KL; Manufacturer: YAGEO; BMS_Part_Number: 9131590; Part_Preference: Recommended; Internal_Part_Number: MCD-00053; Status: Released; Part_Type: Resistor; Package: R0402; ComponentLink1URL: http://tunmcdsvn.tun.st.com/Component_Datasheet_Library/Trunk/Resistors/Yageo_Resistor_RC0402-series; Order_Code_Digikey: 311-10.0KLRCT-ND; Order_Code_Farnell: 9239359; Order_Code_RS: N/A
R37 = MCD-00380: Resistor,130R,0603,1%,1/10W; Manufacturer_Part_Number: RC0603FR-07130RL; Manufacturer: YAGEO; BMS_Part_Number: 9129733; Part_Preference: Recommended; Internal_Part_Number: MCD-00380; Status: Released; Part_Type: Resistor; Package: R0603; ComponentLink1URL: http://tunmcdsvn.tun.st.com/Component_Datasheet_Library/Trunk/Resistors/Yageo_Resistor_RC0603-series; Order_Code_Digikey: 311-130HRCT-ND; Order_Code_Farnell: 1799326; Order_Code_RS: N/A
R38 R39 = MCD-00516: Resistor,75R,0603,1%,1/10W; Manufacturer_Part_Number: RC0603FR-0775RL; Manufacturer: YAGEO; BMS_Part_Number: 9129726; Part_Preference: Recommended; Internal_Part_Number: MCD-00516; Status: Released; Part_Type: Resistor; Package: R0603; ComponentLink1URL: http://tunmcdsvn.tun.st.com/Component_Datasheet_Library/Trunk/Resistors/Yageo_Resistor_RC0603-series; Order_Code_Digikey: 311-75.0HRCT-ND; Order_Code_Farnell: 1799355; Order_Code_RS: N/A
R40 = MCD-00219: Resistor,4K7,0603,1%,1/10W; Manufacturer_Part_Number: RC0603FR-074K7L; Manufacturer: YAGEO; Part_Preference: Recommended; Internal_Part_Number: MCD-00219; Status: Released; Part_Type: Resistor; Package: R0603; ComponentLink1URL: http://tunmcdsvn.tun.st.com/Component_Datasheet_Library/Trunk/Resistors/Yageo_Resistor_RC0603-series; Order_Code_Digikey: 311-4.70KHRCT-ND; Order_Code_Farnell: 9238565; Order_Code_RS: N/A
R41 = MCD-00220: Resistor,10K,0603,1%,1/10W; Manufacturer_Part_Number: RC0603FR-0710KL; Manufacturer: YAGEO; Part_Preference: Recommended; Internal_Part_Number: MCD-00220; Status: Released; Part_Type: Resistor; Package: R0603; ComponentLink1URL: http://tunmcdsvn.tun.st.com/Component_Datasheet_Library/Trunk/Resistors/Yageo_Resistor_RC0603-series; Order_Code_Digikey: 311-10.0KHRCT-ND; Order_Code_Farnell: 9238603; Order_Code_RS: N/A
TS1 = MCD-02082: -Touch Sensing button: diameter 10mm min,  active shield diameter 12mm min; Part_Type: Misc; Part_Preference: Recommended; Manufacturer_Part_Number: Touch_sensing_Button; Internal_Part_Number: MCD-02082; Value: TS_PAD; Status: Released; Manufacturer: N/A; ComponentLink1URL: http://tunmcdsvn.tun.st.com/Component_Datasheet_Library/Trunk/Misc/STM_Touch_Sensing_Button
U18 = MCD-02033: LED, driver for PWM, 4.90 mm × 3.91 mm; Part_Type: IC; Manufacturer: TEXAS INSTRUMENTS; Part_Preference: Recommended; Value: TLC59731DR; Order_Code_Digikey: 296-40590-2-ND; Order_Code_Farnell: 3119199; Order_Code_RS: N/A; Status: Released; ComponentLink1URL: http://tunmcdsvn.tun.st.com/Component_Datasheet_Library/Trunk/IC/TI_3-channel_Led-Driver; Internal_Part_Number: MCD-02033; Manufacturer_Part_Number: TLC59731; Alternate_Manufacturer_Part_Number: N/A; Alternate_Manufacturer: N/A; Package: SOIC
U20 U21 = MCD-02053: Logic AND Gate, 2.90 mm × 1.60 mm; Part_Type: IC; Manufacturer: TEXAS INSTRUMENTS; Part_Preference: Recommended; Order_Code_RS: 6627709; Value: SN74AHC1G08DBVT; Order_Code_Digikey: N/A; Order_Code_Farnell: N/A; Status: Released; ComponentLink1URL: http://tunmcdsvn.tun.st.com/Component_Datasheet_Library/Trunk/IC/TI_Logic-AND-Gate_SN74AHC1G08DBVT; Internal_Part_Number: MCD-02053; Manufacturer_Part_Number: SN74AHC1G08DBVT; Alternate_Manufacturer_Part_Number: N/A; Alternate_Manufacturer: N/A; Package: SOT-23

## Sheet Connectors.SchDoc: Connectors
size A4; Date: Not used; ApprovedBy: Not used; CheckedBy: Not used; Author: Not used; CompanyName: STMicroelectronics; DrawnBy: Not used; Engineer: Not used; Organization: Not used; Address1: Not used; Address2: Not used; Address3: Not used; Address4: Not used; DocumentNumber: Not used; Revision: Not used; SheetNumber: 6; SheetTotal: 8; CurrentTime: Not used; CurrentDate: Not used; Time: Not used; DocumentFullPathAndName: Not used; DocumentName: Not used; ModifiedDate: Not used; ImagePath: Not used; ProjectName: Not used; Application_BuildNumber: Not used
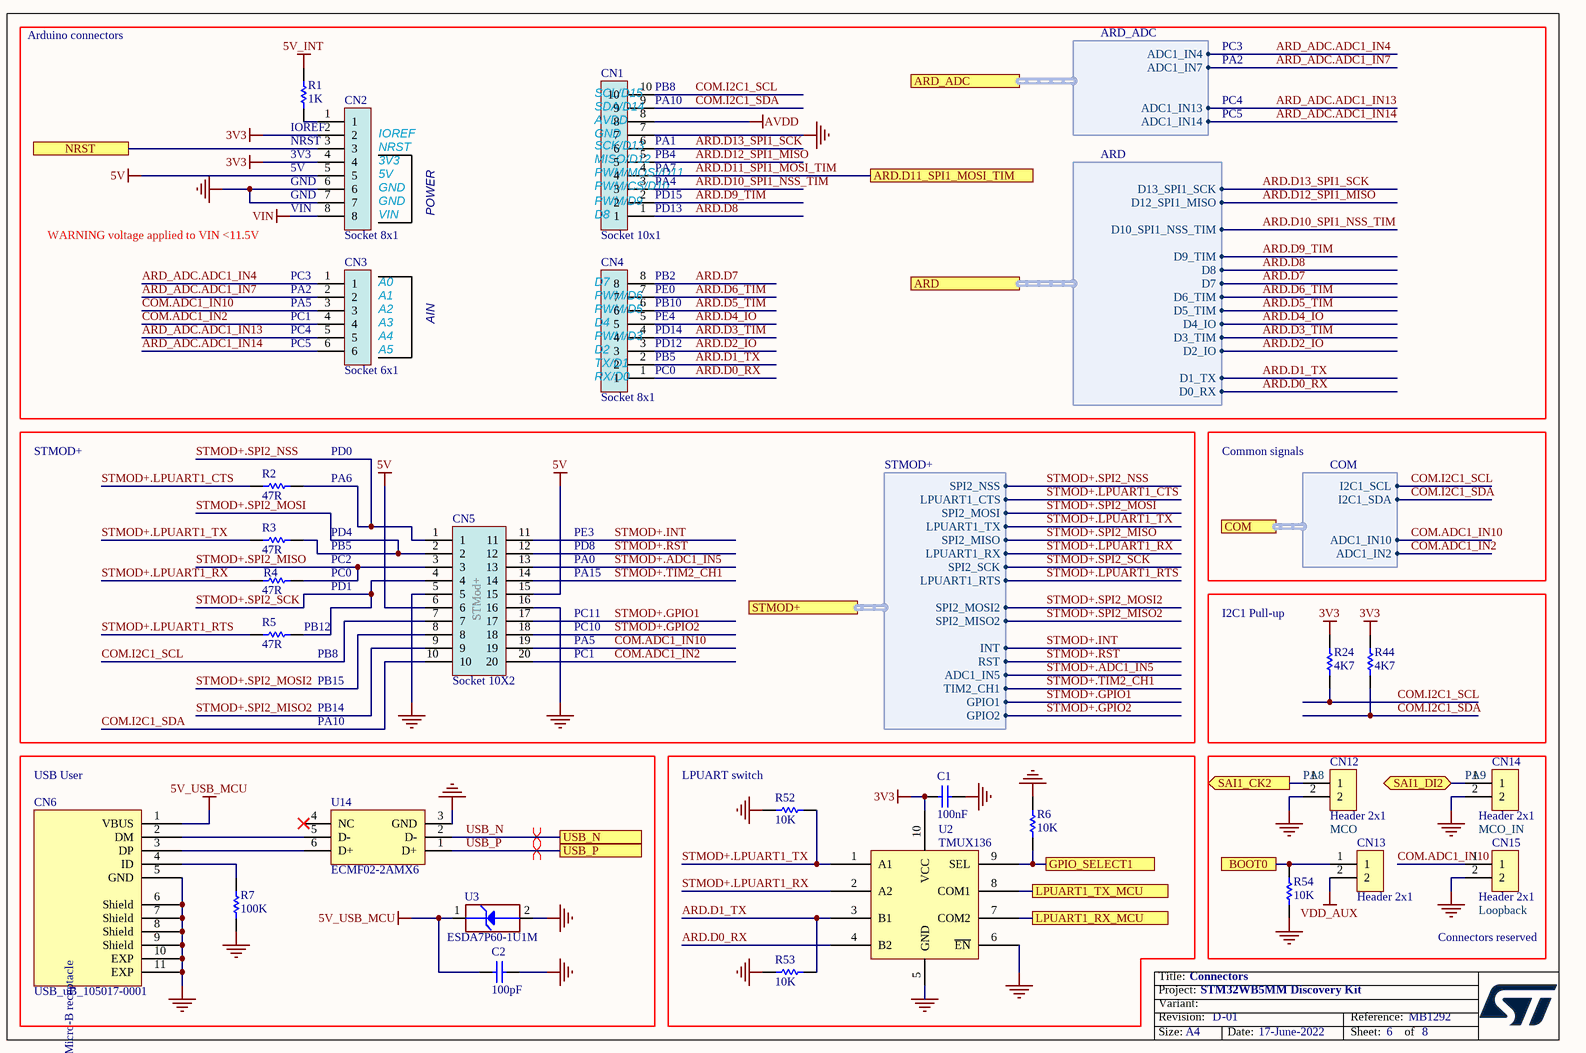
[diagram p3: Connectors.SchDoc]

### Parts
C1  value 100nF  [C0603]  (hidden comment: Capacitor)
C2  value 100pF  [C0603_H0P8]  (hidden comment: Capacitor)
CN1  Socket 10x1  [CON_SAMTEC_SSW-110-22-X-S-VS]
CN2  Socket 8x1  [CON_SAMTEC_SSW-108-22-X-S-VS]
CN3  Socket 6x1  [CON_SAMTEC_SSW-106-22-X-S-VS]
CN4  Socket 8x1  [CON_SAMTEC_SSW-108-22-X-S-VS]
CN5  value Socket 10X2  [CON_SAMTEC_SQT-110-01-F-D-RA__STMOD+]  (hidden comment: Socket 10X2 STMod+)
CN6  value USB_uB_105017-0001  [CON_USBMICROB_MOLEX_105017-0001_H2P90]  (hidden comment: USB_uB_105017.0001)
CN12  Header 2x1  [CON_LYCONN_313102S141346]
CN13  Header 2x1  [CON_LYCONN_313102S141346]
CN14  Header 2x1  [CON_LYCONN_313102S141346]
CN15  Header 2x1  [CON_LYCONN_313102S141346]
R1  value 1K  [R0402]  (hidden comment: Resistor)
R2  value 47R  [R0402]  (hidden comment: Resistor)
R3  value 47R  [R0402]  (hidden comment: Resistor)
R4  value 47R  [R0402]  (hidden comment: Resistor)
R5  value 47R  [R0402]  (hidden comment: Resistor)
R6  value 10K  [R0402]  (hidden comment: Resistor)
R7  value 100K  [R0402]  (hidden comment: Resistor)
R24  value 4K7  [R0603]  (hidden comment: Resistor)
R44  value 4K7  [R0603]  (hidden comment: Resistor)
R52  value 10K  [R0402]  (hidden comment: Resistor)
R53  value 10K  [R0402]  (hidden comment: Resistor)
R54  value 10K  [R0402]  (hidden comment: Resistor)
U2  TMUX136  [ICC_UQFN10_RSE_R-PUQFN-N10_1P5X2_P050]
U3  value ESDA7P60-1U1M  [ESD_QFN2_1P6X1_P125]  (hidden comment: ESD-TRANSIL)
U14  ECMF02-2AMX6  [ESD_QFN-6L_1P7X1P5_P050]

### Blocks framed on the sheet
I2C1 Pull-up: R24 R44
USB User: C2 CN6 R7 U3 U14
LPUART switch: C1 R6 R52 R53 U2

### Ports
ARD (harness ARD), ARD.D11_SPI1_MOSI_TIM, ARD_ADC (harness ARD_ADC), BOOT0, COM (harness COM), GPIO_SELECT1, LPUART1_RX_MCU, LPUART1_TX_MCU, NRST, SAI1_CK2 (out), SAI1_DI2 (bidir), STMOD+ (harness STMOD+), USB_N, USB_P

### Harnesses
ARD_ADC: ADC1_IN4, ADC1_IN7, ADC1_IN13, ADC1_IN14
ARD: D0_RX, D1_TX, D2_IO, D3_TIM, D4_IO, D5_TIM, D6_TIM, D7, D8, D9_TIM, D10_SPI1_NSS_TIM, D12_SPI1_MISO, D13_SPI1_SCK
STMOD+: SPI2_NSS, LPUART1_CTS, SPI2_MOSI, LPUART1_TX, SPI2_MISO, SPI2_SCK, LPUART1_RX, LPUART1_RTS, SPI2_MOSI2, SPI2_MISO2, INT, RST, ADC1_IN5, TIM2_CH1, GPIO1, GPIO2
COM: I2C1_SCL, I2C1_SDA, ADC1_IN10, ADC1_IN2

### Nets
3V3: C1.2 CN2.2 CN2.4 R24.2 R44.2 U2.10(VCC)
5V: CN2.5 CN5.6 CN5.15
5V_INT: R1.2
5V_USB_MCU: C2.1 CN6.1(VBUS) U3.1(IO1)
AVDD: CN1.8
GND: C1.1 C2.2 CN1.7 CN2.6 CN2.7 CN5.5 CN5.16 CN6.5(GND) CN6.6(Shield) CN6.7(Shield) CN6.8(Shield) CN6.9(Shield) CN6.10(EXP) CN6.11(EXP) CN12.2 CN14.2 CN15.2 R6.2 R7.1 R52.1 R53.1 R54.1 U2.5(GND) U2.6(~{EN}) U3.2(GND) U14.3(GND)
VDD_AUX: CN13.2
VIN: CN2.8
ARD.D0_RX: CN4.1 U2.4(B2) ; port ARD.D0_RX
ARD.D1_TX: CN4.2 R53.2 U2.3(B1) ; port ARD.D1_TX
ARD.D2_IO: CN4.3 ; port ARD.D2_IO
ARD.D3_TIM: CN4.4 ; port ARD.D3_TIM
ARD.D4_IO: CN4.5 ; port ARD.D4_IO
ARD.D5_TIM: CN4.6 ; port ARD.D5_TIM
ARD.D6_TIM: CN4.7 ; port ARD.D6_TIM
ARD.D7: CN4.8 ; port ARD.D7
ARD.D8: CN1.1 ; port ARD.D8
ARD.D9_TIM: CN1.2 ; port ARD.D9_TIM
ARD.D10_SPI1_NSS_TIM: CN1.3 ; port ARD.D10_SPI1_NSS_TIM
ARD.D11_SPI1_MOSI_TIM: CN1.4 ; port ARD.D11_SPI1_MOSI_TIM
ARD.D12_SPI1_MISO: CN1.5 ; port ARD.D12_SPI1_MISO
ARD.D13_SPI1_SCK: CN1.6 ; port ARD.D13_SPI1_SCK
ARD_ADC.ADC1_IN4: CN3.1 ; port ARD_ADC.ADC1_IN4
ARD_ADC.ADC1_IN7: CN3.2 ; port ARD_ADC.ADC1_IN7
ARD_ADC.ADC1_IN13: CN3.5 ; port ARD_ADC.ADC1_IN13
ARD_ADC.ADC1_IN14: CN3.6 ; port ARD_ADC.ADC1_IN14
BOOT0: CN13.1 R54.2 ; port BOOT0
COM.ADC1_IN2: CN3.4 CN5.20 ; port COM.ADC1_IN2
COM.ADC1_IN10: CN3.3 CN5.19 CN15.1 ; port COM.ADC1_IN10
COM.I2C1_SCL: CN1.10 CN5.7 R24.1 ; port COM.I2C1_SCL
COM.I2C1_SDA: CN1.9 CN5.10 R44.1 ; port COM.I2C1_SDA
GPIO_SELECT1: R6.1 U2.9(SEL) ; port GPIO_SELECT1
LPUART1_RX_MCU: U2.7(COM2) ; port LPUART1_RX_MCU
LPUART1_TX_MCU: U2.8(COM1) ; port LPUART1_TX_MCU
NRST: CN2.3 ; port NRST
SAI1_CK2: CN12.1 ; port SAI1_CK2
SAI1_DI2: CN14.1 ; port SAI1_DI2
STMOD+.ADC1_IN5: CN5.13 ; port STMOD+.ADC1_IN5
STMOD+.GPIO1: CN5.17 ; port STMOD+.GPIO1
STMOD+.GPIO2: CN5.18 ; port STMOD+.GPIO2
STMOD+.INT: CN5.11 ; port STMOD+.INT
STMOD+.LPUART1_CTS: R2.1 ; port STMOD+.LPUART1_CTS
STMOD+.LPUART1_RTS: R5.1 ; port STMOD+.LPUART1_RTS
STMOD+.LPUART1_RX: R4.1 U2.2(A2) ; port STMOD+.LPUART1_RX
STMOD+.LPUART1_TX: R3.1 R52.2 U2.1(A1) ; port STMOD+.LPUART1_TX
STMOD+.RST: CN5.12 ; port STMOD+.RST
STMOD+.SPI2_MISO: CN5.3 R4.2 ; port STMOD+.SPI2_MISO
STMOD+.SPI2_MISO2: CN5.9 ; port STMOD+.SPI2_MISO2
STMOD+.SPI2_MOSI: CN5.2 R3.2 ; port STMOD+.SPI2_MOSI
STMOD+.SPI2_MOSI2: CN5.8 ; port STMOD+.SPI2_MOSI2
STMOD+.SPI2_NSS: CN5.1 R2.2 ; port STMOD+.SPI2_NSS
STMOD+.SPI2_SCK: CN5.4 R5.2 ; port STMOD+.SPI2_SCK
STMOD+.TIM2_CH1: CN5.14 ; port STMOD+.TIM2_CH1
USB_N: U14.2(D-) ; port USB_N
USB_P: U14.1(D+) ; port USB_P
NetCN2_1: CN2.1 R1.1
NetCN6_2: CN6.2(DM) U14.5(D-)
NetCN6_3: CN6.3(DP) U14.6(D+)
NetCN6_4: CN6.4(ID) R7.2

Not connected (* = marked no-connect by the designer): U14 4(NC)*

### Layout directives
differential pair: USB_N, USB_P

### Notes on the sheet
- Arduino connectors
- PC3
- (near CN1) SDA/D14
- (near CN1) SCL/D15
- (near CN1) AVDD
- (near CN1) PB8
- (near CN1) PA10
- PC4
- PA2
- PC5
- IOREF
- NRST
- 3V3
- 5V
- (near CN2) GND
- (near CN2) IOREF
- (near CN2) NRST
- (near CN2) 3V3
- (near CN2) 5V
- (near CN1) PWM/CS/D10
- (near CN1) SCK/D13
- (near CN1) MISO/D12
- (near CN1) PWM/MOSI/D11
- (near CN1) GND
- (near CN1) PA1
- (near CN1) PB4
- (near CN1) PA7
- (near CN1) PA4
- WARNING voltage applied to VIN <11.5V
- (near CN2) VIN
- POWER
- (near CN1) D8
- (near CN1) PWM/D9
- (near CN1) PD15
- (near CN1) PD13
- (near CN3) PC3
- (near CN3) PA2
- (near CN3) PA5
- (near CN3) PC1
- (near CN3) A0
- (near CN3) A1
- (near CN3) A2
- AIN
- (near CN4) PWM/D5
- (near CN4) PWM/D6
- (near CN4) D7
- (near CN4) PB2
- (near CN4) PE0
- (near CN4) PB10
- (near CN4) PE4
- (near CN3) PC4
- (near CN3) PC5
- (near CN3) A3
- (near CN3) A4
- (near CN3) A5
- (near CN4) RX/D0
- (near CN4) TX/D1
- (near CN4) D2
- (near CN4) D4
- (near CN4) PWM/D3
- (near CN4) PD14
- (near CN4) PD12
- (near CN4) PB5
- (near CN4) PC0
- STMOD+
- (near R2) PD0
- Common signals
- (near R2) PA6
- PD4
- PB5
- PC2
- PC0
- PD1
- PE3
- PD8
- PA0
- PA15
- (near R5) PB12
- (near R5) PB8
- PC11
- PA5
- PC10
- PC1
- (near R5) PB15
- PB14
- PA10
- (near CN12) PA8
- (near CN14) PA9
- MCO
- MCO_IN
- (near CN15) Loopback
- Connectors reserved
- Title:
- Project:
- Size:
- Revision:
- Variant:
- -
- Date:
- Reference:
- Sheet:
- of
- (in symbol MCD-00028) USB_Micro-B receptacle
- (in symbol MCD-00309) STMod+

### Library data of the parts
C1 = MCD-02119: Capacitor, MLCC, 100nF, 6V3, X5R, 10%, 0603, T=0,8mm; Part_Preference: Recommended; Manufacturer: KEMET; Manufacturer_Part_Number: C0603C104K9PACTU; Internal_Part_Number: MCD-02119; Status: Checked; Part_Type: Capacitor; Alternate_Manufacturer: N/A; Alternate_Manufacturer_Part_Number: N/A; Package: C0603; ComponentLink1URL: http://tunmcdsvn.tun.st.com/Component_Datasheet_Library/Trunk/Capacitors/KEMET_Capacitor_X5R-series/KEMET_Capacitor_C0603C104K9PACTU; Order_Code_Digikey: N/A; Order_Code_Farnell: 2941311; Order_Code_RS: N/A
C2 = MCD-01648: Capacitor,MLCC,100pF 50V,NPO,+/-5%, 0603,T=0,8mm; Manufacturer_Part_Number: CC0603JRNPO9BN101; Manufacturer: YAGEO; Part_Preference: Recommended; Order_Code_RS: 625-0267; Internal_Part_Number: MCD-01648; Status: Released; Part_Type: Capacitor; Package: C0603; ComponentLink1URL: http://tunmcdsvn.tun.st.com/Component_Datasheet_Library/Trunk/Capacitors/Yageo_UPY-GP_NP0_16V-to-50V/YAGEO_NP0_UPY-GP_NP0_16V-to-50V_16.pdf; Order_Code_Digikey: 311-1069-1-ND; Order_Code_Farnell: 722080
CN1 = MCD-00301: Socket, 10x1, 2.54mm, VR, SMT, Height 9.78mm; Part_Type: Connector; Manufacturer_Part_Number: SSW-110-22-L-S-VS; Manufacturer: SAMTEC; Part_Preference: Recommended; Internal_Part_Number: MCD-00301; Value: Socket 10x1; Status: Checked; ComponentLink1URL: http://tunmcdsvn.tun.st.com/Component_Datasheet_Library/Trunk/Connectors/Samtec_SSW_smt_series
CN2 CN4 = MCD-00300: Socket, 8x1, 2.54mm, VR, SMT, Height 9.78mm; Part_Type: Connector; Manufacturer_Part_Number: SSW-108-22-L-S-VS; Manufacturer: SAMTEC; Part_Preference: Recommended; Internal_Part_Number: MCD-00300; Value: Socket 8x1; Status: Checked; ComponentLink1URL: http://tunmcdsvn.tun.st.com/Component_Datasheet_Library/Trunk/Connectors/Samtec_SSW_smt_series
CN3 = MCD-00299: Socket, 6x1, 2.54mm, VR, SMT, Height 9.78mm; Part_Type: Connector; Manufacturer_Part_Number: SSW-106-22-L-S-VS; Manufacturer: SAMTEC; Part_Preference: Recommended; Internal_Part_Number: MCD-00299; Value: Socket 6x1; Status: Checked; ComponentLink1URL: http://tunmcdsvn.tun.st.com/Component_Datasheet_Library/Trunk/Connectors/Samtec_SSW_smt_series
CN5 = MCD-00309: Socket, 10x2, 2mm, RA, TH, T=6.35mm/2.29mm; Part_Type: Connector; Part_Preference: Recommended; Manufacturer: SAMTEC; Manufacturer_Part_Number: SQT-110-01-F-D-RA; Order_Code_RS: 180-1541; Component_Country_Of_Origin: China, Costa Rica, Malaysia, United States, Vietnam; Internal_Part_Number: MCD-00309; Status: Released; ComponentLink1URL: http://tunmcdsvn.tun.st.com/Component_Documentation_Library/Trunk/Connector/SAMTEC_SQT_Series/; Order_Code_Digikey: SAM10734-ND; Order_Code_Farnell: 2856563
CN6 = MCD-00028: USB-MICRO-B, 0.65mm, RA, SMT, Bottom Mount,; Manufacturer_Part_Number: 1050170001; Manufacturer: MOLEX; Part_Type: Connector; Part_Preference: Recommended; Internal_Part_Number: MCD-00028; Status: Released; ComponentLink1URL: http://tunmcdsvn.tun.st.com/Component_Datasheet_Library/Trunk/Connectors/Molex_Connector-USB-microB_105017-0001
CN12-CN15 = MCD-01668: Header 2x1, 2.54mm, VR, TH, height 5.84mm/5.08 mm, height total 13.46 mm; Part_Type: Connector; Manufacturer_Part_Number: 313102S141346; Manufacturer: LYCONN; Part_Preference: Recommended; Internal_Part_Number: MCD-01668; Value: Header 2x1; Status: Released; ComponentLink1URL: http://tunmcdsvn.tun.st.com/Component_Datasheet_Library/Trunk/Connectors/LYCONN_31XXX_2.54mm_L13.46mm/LYCONN_31XXX_2.54mm_L13.46mm.pdf
R1 = MCD-00061: as R12 on sheet LEDs_Buttons; Internal_Part_Number: MCD-00061; Status: Released; Part_Type: Resistor; Package: R0402; ComponentLink1URL: http://tunmcdsvn.tun.st.com/Component_Datasheet_Library/Trunk/Resistors/Yageo_Resistor_RC0402-series; Order_Code_Digikey: 311-1.00KLRCT-ND; Order_Code_Farnell: 9239235; Order_Code_RS: N/A
R2-R5 = MCD-00481: Resistor,47R,0402,1%,1/16W; Manufacturer_Part_Number: RC0402FR-0747RL; Manufacturer: YAGEO; Part_Preference: Recommended; Internal_Part_Number: MCD-00481; Status: Released; Part_Type: Resistor; Package: R0402; ComponentLink1URL: http://tunmcdsvn.tun.st.com/Component_Datasheet_Library/Trunk/Resistors/Yageo_Resistor_RC0402-series; Order_Code_Digikey: 311-47.0LRCT-ND; Order_Code_Farnell: 9239073; Order_Code_RS: N/A
R6 R52-R54 = MCD-00053: as R13 on sheet LEDs_Buttons; Internal_Part_Number: MCD-00053; Status: Released; Part_Type: Resistor; Package: R0402; ComponentLink1URL: http://tunmcdsvn.tun.st.com/Component_Datasheet_Library/Trunk/Resistors/Yageo_Resistor_RC0402-series; Order_Code_Digikey: 311-10.0KLRCT-ND; Order_Code_Farnell: 9239359; Order_Code_RS: N/A
R7 = MCD-00059: Resistor,100K,0402,1%,1/16W; Manufacturer_Part_Number: RC0402FR-07100KL; Manufacturer: YAGEO; Alternate_Manufacturer_Part_Number: RT0402FRE07100KL; Part_Preference: Recommended; Internal_Part_Number: MCD-00059; Alternate_Manufacturer: YAGEO; Status: Released; Part_Type: Resistor; ComponentLink1URL: http://tunmcdsvn.tun.st.com/Component_Datasheet_Library/Trunk/Resistors/Yageo_Resistor_RC0402-series; Package: R0402; Order_Code_Digikey: 311-100KLRTR-ND; Order_Code_Farnell: 2421891; Order_Code_RS: N/A
R24 R44 = MCD-00219: as R40 on sheet LEDs_Buttons; Internal_Part_Number: MCD-00219; Status: Released; Part_Type: Resistor; Package: R0603; ComponentLink1URL: http://tunmcdsvn.tun.st.com/Component_Datasheet_Library/Trunk/Resistors/Yageo_Resistor_RC0603-series; Order_Code_Digikey: 311-4.70KHRCT-ND; Order_Code_Farnell: 9238565; Order_Code_RS: N/A
U2 = MCD-01847: 6-GHz, 2-Channel, 2:1 Switch, With Power-off Isolation; Part_Type: IC; Manufacturer: TEXAS INSTRUMENTS; Part_Preference: Recommended; Internal_Part_Number: MCD-01847; Status: Checked; Manufacturer_Part_Number: TMUX136; ComponentLink1URL: http://tunmcdsvn.tun.st.com/Component_Datasheet_Library/Trunk/IC/TI_2-channel_switch_TMUX136; Value: TMUX136; Package: UQFN-10; Order_Code_Digikey: 296-47396-1-ND; Order_Code_Farnell: 2802932RL; Order_Code_RS: N/A
U3 = MCD-00251: High power transient voltage suppressor, 7V breakdown; Part_Type: Diode; Manufacturer: STMICROELECTRONICS; BMS_Part_Number: 9179042; Part_Preference: Recommended; Manufacturer_HQ_COO: EU; Internal_Part_Number: MCD-00251; Status: Released; Manufacturer_Part_Number: ESDA7P60-1U1M; ComponentLink1URL: http://tunmcdsvn.tun.st.com/Component_Datasheet_Library/Trunk/Diodes/STM_ESD_ESDA7P60-1U1M
U14 = MCD-00649: Common mode filter with ESD protection for USB 2.0 interface; Part_Type: Diode; Manufacturer: STMICROELECTRONICS; BMS_Part_Number: 9151138; Part_Preference: Recommended; Manufacturer_HQ_COO: EU; Internal_Part_Number: MCD-00649; Value: ECMF02-2AMX6; Status: Released; Manufacturer_Part_Number: ECMF02-2AMX6; ComponentLink1URL: http://tunmcdsvn.tun.st.com/Component_Datasheet_Library/Trunk/Diodes/STM_ESD_ECMF02-2AMX6